# EasyEDA Pro project SubGhz_Module.epro

# Schematic SubGHz Mode
Board Name: PCB2; Create Date: 2026-04-15; Page Name: P1; Project Name: ESP32_Buspirate_complete; Schematic Name: SubGHz Mode; Update Date: 2026-04-15; Company: EasyEDA.com; Page Size: A4; Version: V1.0
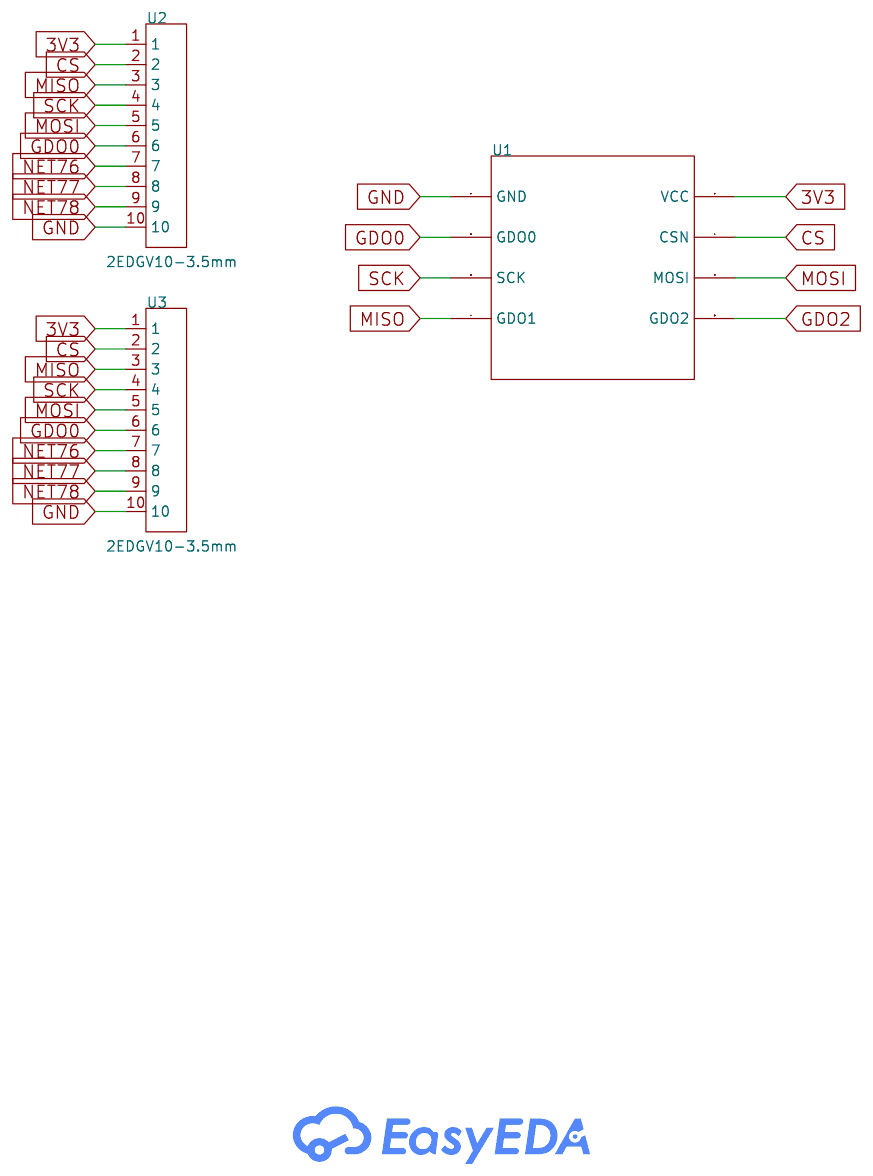
[diagram p0: schematic sheet]

## Parts
U1  -  [CC1101-1]
U2  2EDGV10-3.5mm  [CONN-TH_10P-P2.50_B10B-EH-A-LF-SN]
U3  2EDGV10-3.5mm  [CONN-TH_10P-P2.50_B10B-EH-A-LF-SN]

## Library data of the parts
U1 = cc1101
U2 U3 = CONN-TH_10P-P3.50: Supplier Part: C9900014909; Supplier Footprint: 2EDG_10p_3.5mm; JLCPCB Part Class: Extended Part; Supplier: LCSC

## Nets
3V3: U1.2(VCC) U2.1 U3.1
GND: U1.1(GND) U2.10 U3.10
CS: U1.4(CSN) U2.2 U3.2
GDO0: U1.3(GDO0) U2.6 U3.6
GDO2: U1.8(GDO2)
MISO: U1.7(GDO1) U2.3 U3.3
MOSI: U1.6(MOSI) U2.5 U3.5
NET76: U2.7 U3.7
NET77: U2.8 U3.8
NET78: U2.9 U3.9
SCK: U1.5(SCK) U2.4 U3.4

# Board PCB2
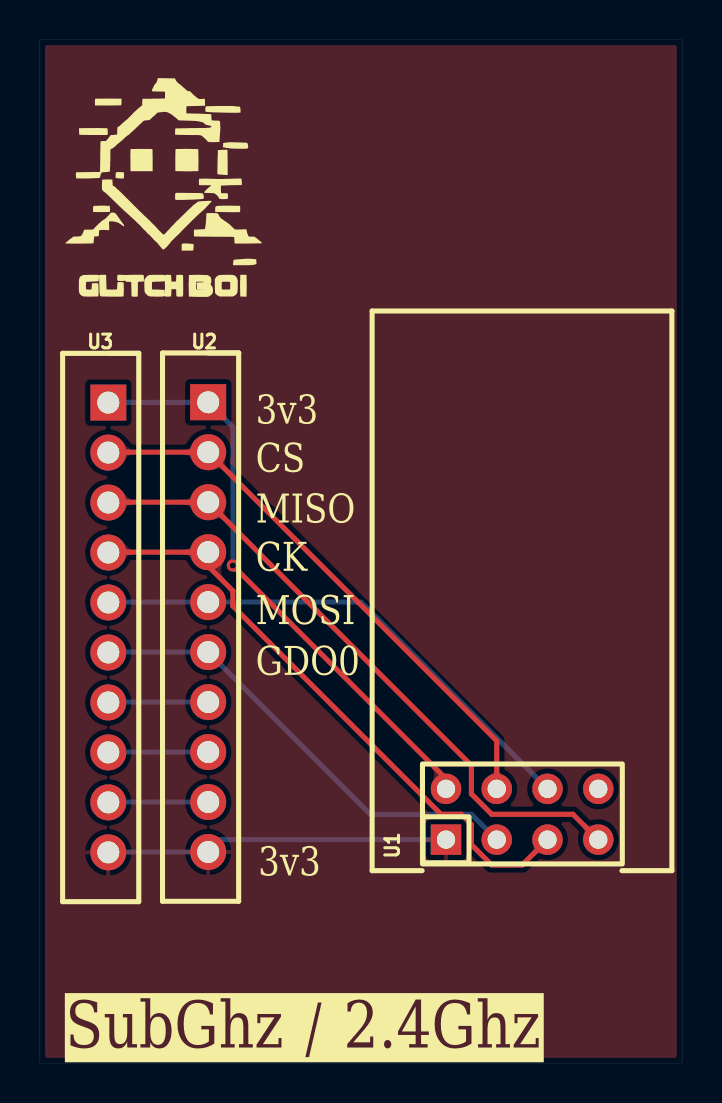
[diagram p1: board, top side]
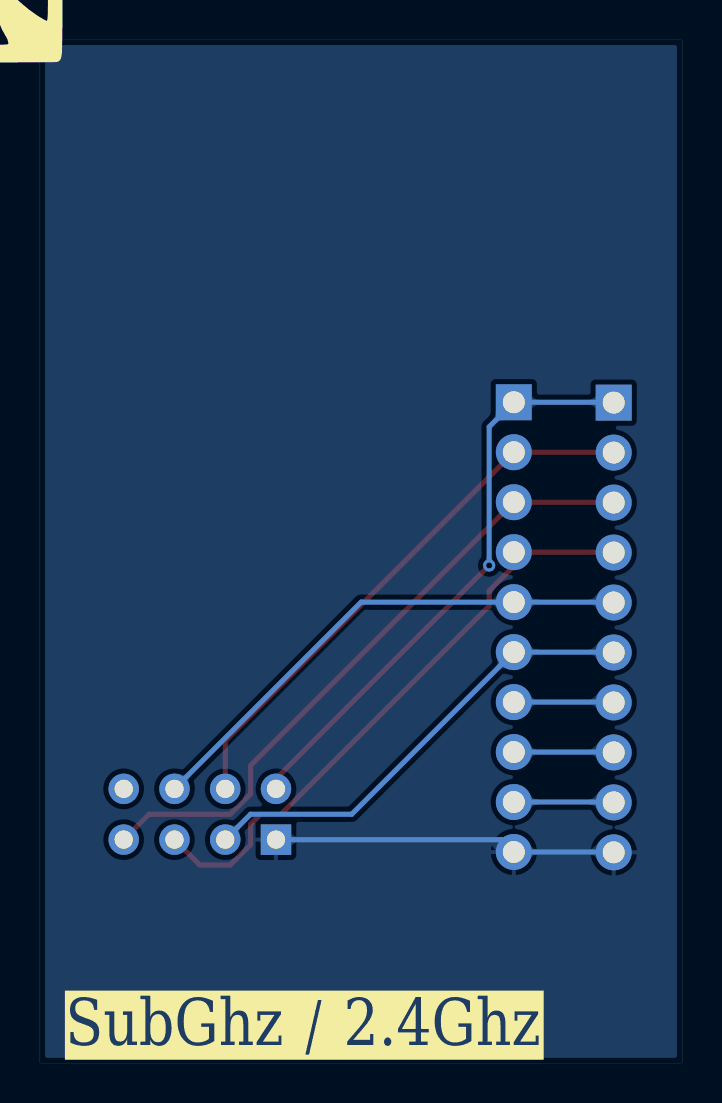
[diagram p2: board, bottom side, seen from below]

Outline 32.13 x 51.18 mm; copper layers: Top Layer, Bottom Layer. Coordinates in mm from the lower left corner of the outline.
Outline path: rectangle 0,51.18 32.13,0
Stack: Top Layer 0.035mm / Dielectric1 1.51mm FR4 er 4.5 / Bottom Layer 0.035mm

## Design rules (mm)
template: JLCPCB Capability(Two Layers Board)
spacing copperThickness1oz (default): track to track 0.102, other pairs 0.152 to 0.3
spacing copperThickness2oz: track to track 0.203, other pairs 0.152 to 0.3
track width copperThickness1oz (default): min 0.127, default 0.254, max 2.54
track width copperThickness2oz: min 0.203, default 0.254, max 2.54
differential pair differentialPair (default): width min 0.127, default 0.254, max 2.54; gap min 0.152, default 0.152
via viaSize (default): diameter min 0.5, default 0.61, max 10; hole min 0.3, default 0.305, max 6.3

## Placement (name value [footprint] x y rotation side)
U1  -  [CC1101-1]  30.48 8.64 90 top
U2  2EDGV10-3.5mm  [CONN-TH_10P-P2.50_B10B-EH-A-LF-SN]  8.42 21.81 270 top
U3  2EDGV10-3.5mm  [CONN-TH_10P-P2.50_B10B-EH-A-LF-SN]  3.42 21.79 270 top

## Footprints (pads in the part's own frame, mm; a bottom-side part is the same pattern mirrored in y, then rotated)
CC1101-1
  rect 1.524x1.524 hole 0.914: 1(2.54,10.16)
  round 1.524 hole 0.914: 2(5.08,10.16) 3(2.54,7.62) 4(5.08,7.62) 5(2.54,5.08) 6(5.08,5.08) 7(2.54,2.54) 8(5.08,2.54)
CONN-TH_10P-P2.50_B10B-EH-A-LF-SN
  rect 1.8x1.8 hole 1.1: 1(-11.25,0)
  round 1.8 hole 1.1: 2(-8.75,0) 3(-6.25,0) 4(-3.75,0) 5(-1.25,0) 6(1.25,0) 7(3.75,0) 8(6.25,0) 9(8.75,0) 10(11.25,0)

## Nets
As in the schematic.

## Via types
v1: diameter 0.61, hole 0.305, Top Layer to Bottom Layer, 1 via

## Routing (per net, layer and track width the routed paths; a pad name or vN(x,y) marks a point on that pad's centre or on a via; arc(x,y) is an arc through that point)
3V3: length 29.3
  Top Layer w0.254: v1(9.65,24.89) 20.32,14.22 U1.2
  Bottom Layer w0.254: v1(9.65,24.89) 9.65,31.82 U2.1 3.44,33.06 U3.1
GND: length 17.2
  Bottom Layer w0.254: U1.1 9.04,11.18 U2.10 3.44,10.56 U3.10
CS: length 27.8
  Top Layer w0.254: U1.4 22.86,16.12 U2.2 3.44,30.56 U3.2
GDO0: length 23.3
  Bottom Layer w0.254: U3.6 3.44,20.56 U2.6 16.53,12.45 21.59,12.45 U1.3
MISO: length 32.4
  Top Layer w0.254: U1.7 26.67,12.45 22.61,12.45 21.59,13.46 21.59,14.89 U2.3 3.44,28.06 U3.3
MOSI: length 25.9
  Bottom Layer w0.254: U3.5 3.44,23.06 U2.5 16.06,23.06 25.4,13.72
NET76: length 5
  Bottom Layer w0.254: U3.7 3.44,18.06 U2.7
NET77: length 5
  Bottom Layer w0.254: U3.8 3.44,15.56 U2.8
NET78: length 5
  Bottom Layer w0.254: U3.9 3.44,13.06 U2.9
SCK: length 30.4
  Top Layer w0.254: U3.4 3.44,25.56 U2.4 8.42,24.85 9.65,23.62 9.65,22.86 20.07,12.45 21.08,12.45 21.59,11.94 21.59,10.92 22.61,9.91 24.13,9.91 25.4,11.18

## Copper pours and planes (outline as drawn; the poured copper is in the pictures)
GND on Top Layer: 0,51.18 32.13,51.18 32.13,0 0,0
GND on Bottom Layer: 0,51.05 32.13,51.05 32.13,0 0,0

Small or netless copper shapes (teardrops, artwork), in the pictures only: 14 on Top Layer, 22 on Bottom Layer

## Text on the board
Bottom Silkscreen Layer: SubGhz / 2.4Ghz
Top Silkscreen Layer: 3v3 | CS | MISO | CK | MOSI | GDO0 | SubGhz / 2.4Ghz
